# Altium project PCB_Project2.PrjPCB
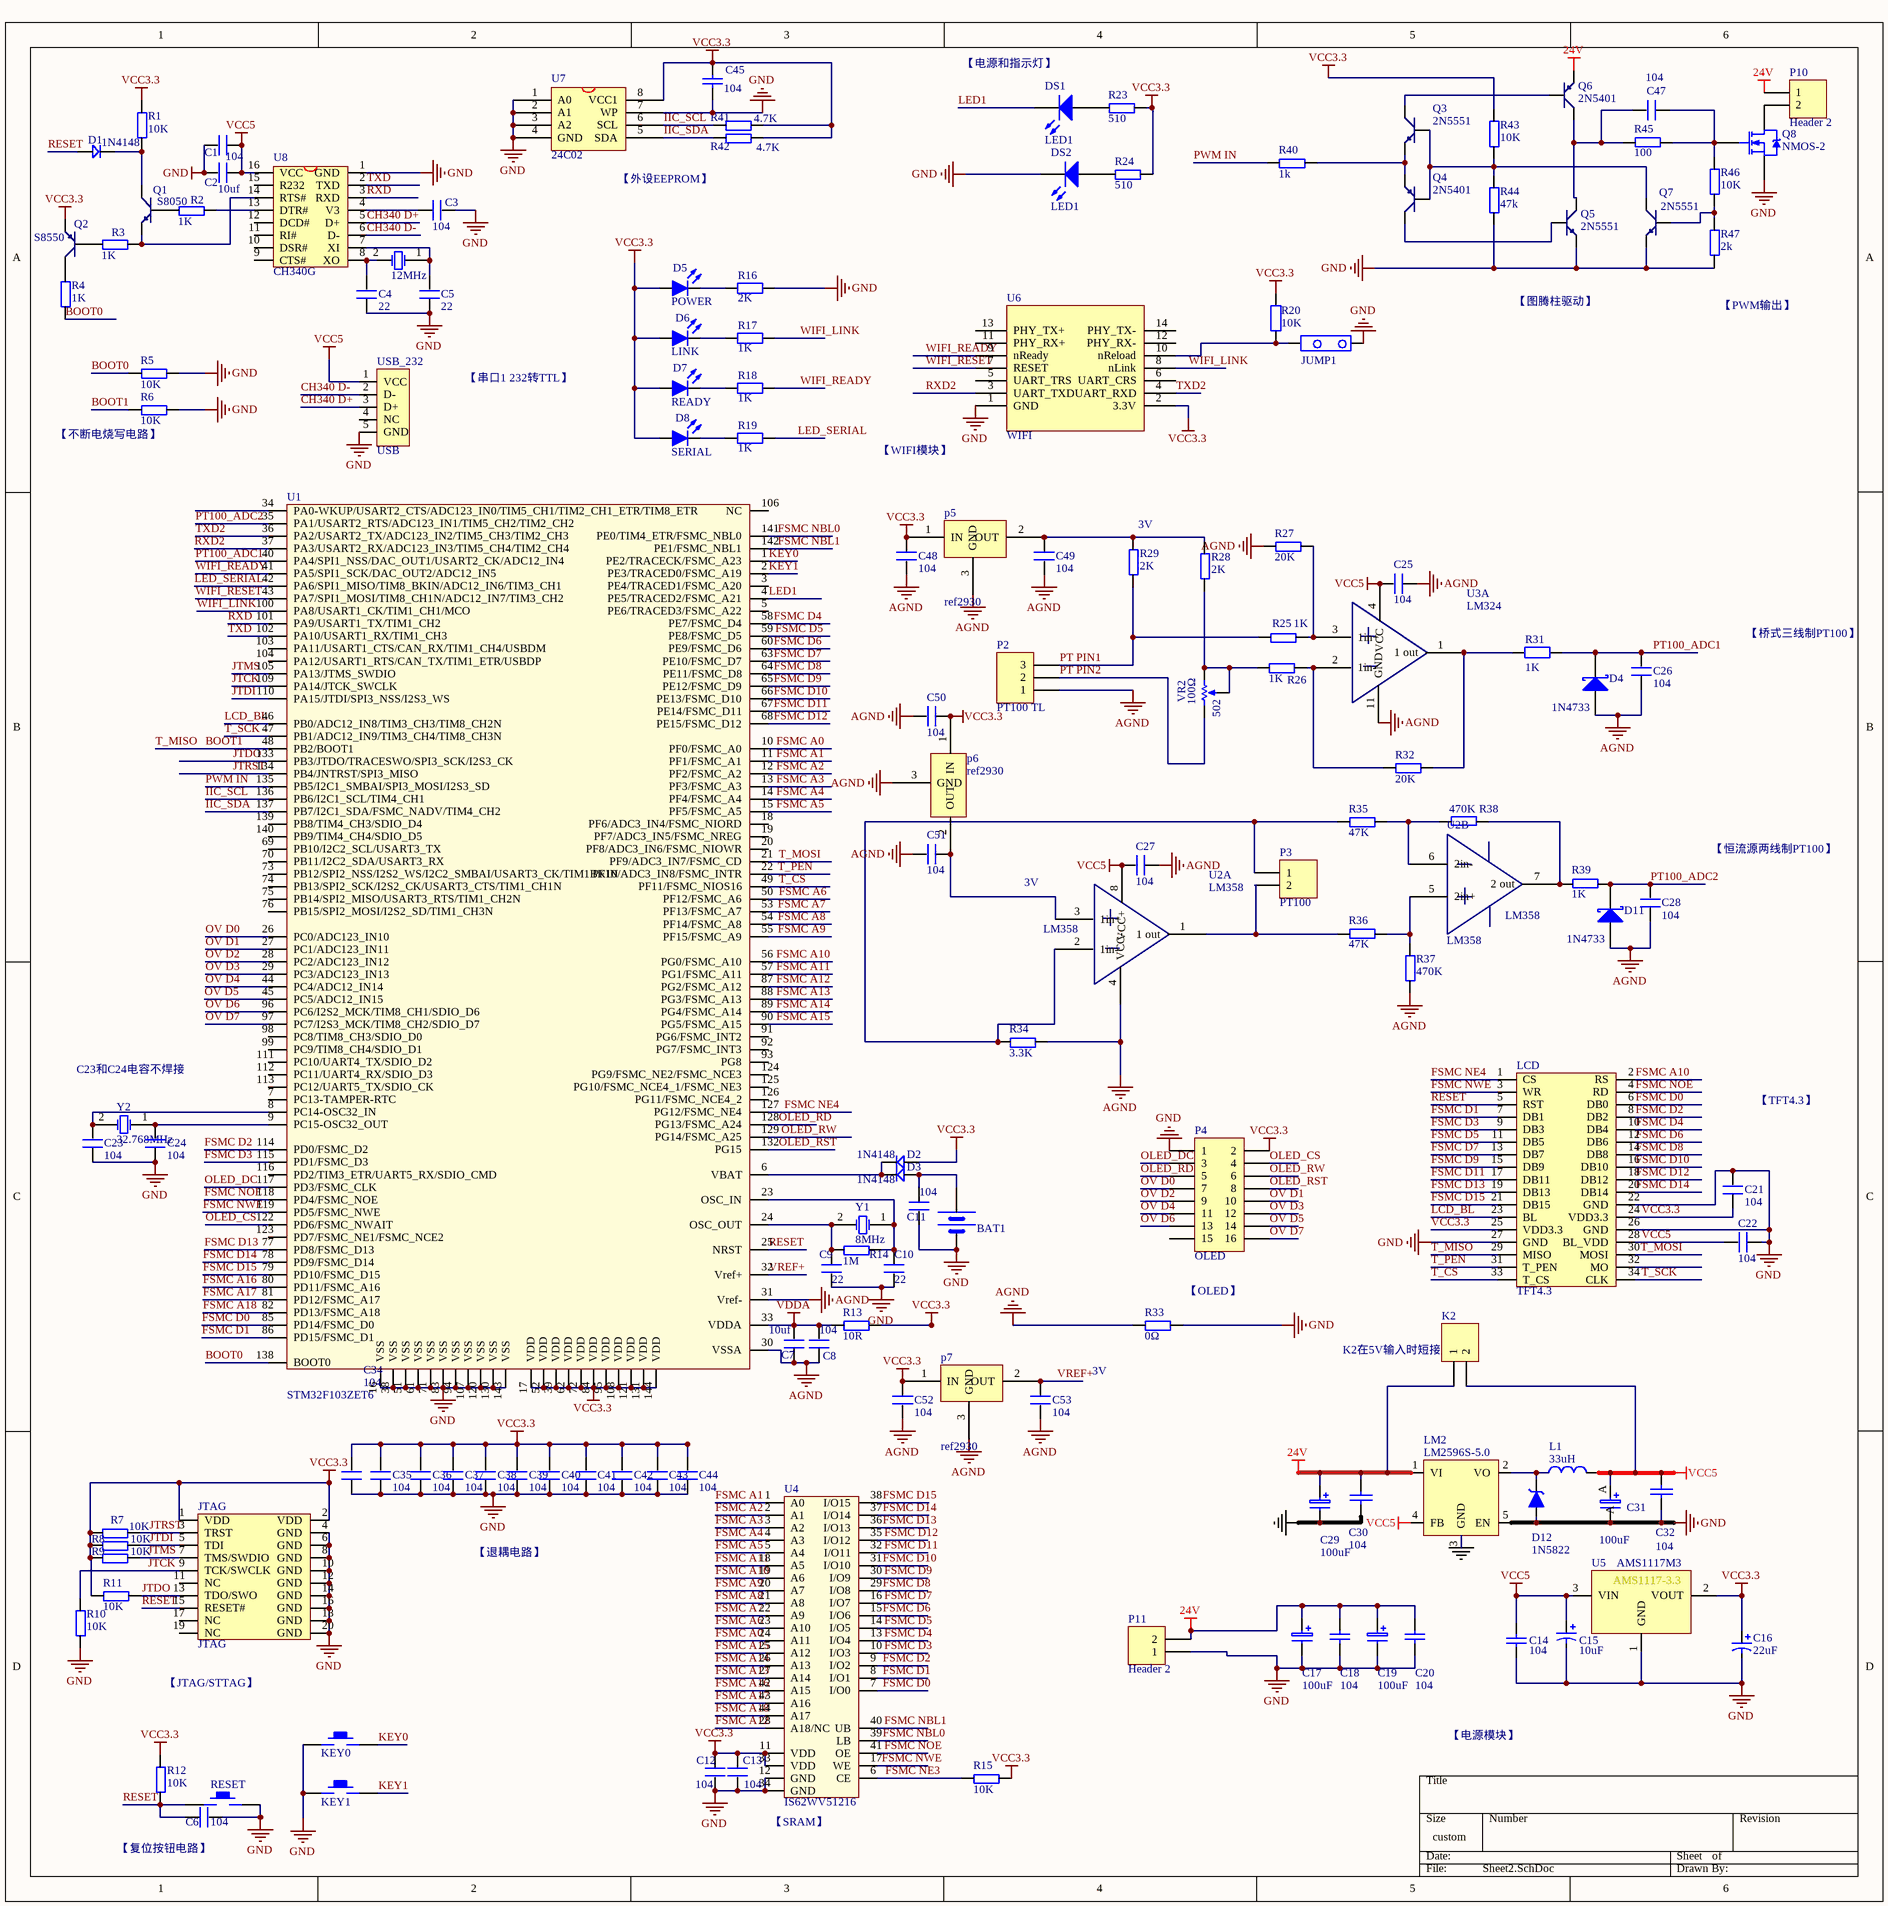
[diagram p0: Sheet2.SchDoc]
1 sheet, 146 parts. Net scope: global (net labels, ports and power ports of the same name join across sheets).
Board file: PCB1.PcbDoc

## Sheet Sheet2.SchDoc
size 381 x 381 mm

### Parts
BAT1  BATT  [BATM]  (value not drawn)
C1  104  [0805]
C2  10uf  [0805]
C3  104  [0805]
C4  22  [0805]
C5  22  [0805]
C6  104  [0805]
C7  10uf  [0805]
C8  104  [0805]
C9  22  [0805]
C10  22  [0805]
C11  104  [0805]
C12  104  [0805]
C13  104  [0805]
C14  104  [0805]
C15  10uF  [CASE-3216A]
C16  22uF  [RVT 22UF 25V]
C17  100uF  [CC8*10.5]
C18  104  [0805]
C19  100uF  [CC8*10.5]
C20  104  [0805]
C21  104  [0805]
C22  104  [0805]
C23  104  [0805]
C24  104  [0805]
C25  104  [0805]
C26  104  [0805]
C27  104  [0805]
C28  104  [0805]
C29  100uF  [CC8*10.5]
C30  104  [0805]
C31  100uF  [rvt 100uf /25V]
C32  104  [0805]
C34  104  [0805]
C35  104  [0805]
C36  104  [0805]
C37  104  [0805]
C38  104  [0805]
C39  104  [0805]
C40  104  [0805]
C41  104  [0805]
C42  104  [0805]
C43  104  [0805]
C44  104  [0805]
C45  value 104  [0805]  (hidden comment: Cap)
C47  104  [0805]
C48  104  [0805]
C49  104  [0805]
C50  104  [0805]
C51  104  [0805]
C52  104  [0805]
C53  104  [0805]
D1  1N4148  [DIODE_SOP]
D2  1N4148  [DIODE_SOP]
D3  1N4148  [DIODE_SOP]
D4  1N4733  [LC-DO-41]
D5  POWER  [SMDLED]
D6  LINK  [SMDLED]
D7  READY  [SMDLED]
D8  SERIAL  [SMDLED]
D11  1N4733  [LC-DO-41]
D12  1N5822  [1n5822]
DS1  LED1  [SMDLED]
DS2  LED1  [SMDLED]
JTAG  JTAG  [JTAG_20]
JUMP1  Jumper  [HDR1X2]  (value not drawn)
K2  Header 2  [HDR1X2]  (value not drawn)
KEY0  KEY_M  [KEY_M]  (value not drawn)
KEY1  KEY_M  [KEY_M]  (value not drawn)
L1  33uH  [100UH]
LCD  TFT4.3  [DB2*17-3.5]
LM2  LM2596S-5.0  [LM2596S-5.0]
P2  PT100 TL  [3SPI]
P3  PT100  [2SPI]
P4  OLED  [HDR2X8]
p5  ref2930  [LC-SOT-23(SOT-23-3)]
p6  ref2930  [LC-SOT-23(SOT-23-3)]
p7  ref2930  [LC-SOT-23(SOT-23-3)]
P10  Header 2  [2SPI]
P11  Header 2  [2SPI]
Q1  S8050  [SOT-23R]
Q2  S8550  [SOT-23R]
Q3  2N5551  [SOT-23R]
Q4  2N5401  [SOT-23R]
Q5  2N5551  [SOT-23R]
Q6  2N5401  [SOT-23R]
Q7  2N5551  [SOT-23R]
Q8  NMOS-2  [LC-TO-263-2]
R1  10K  [0805]
R2  1K  [0805]
R3  1K  [0805]
R4  1K  [0805]
R5  10K  [0805]
R6  10K  [0805]
R7  10K  [0805]
R8  10K  [0805]
R9  10K  [0805]
R10  10K  [0805]
R11  10K  [0805]
R12  10K  [0805]
R13  10R  [0805]
R14  1M  [0805]
R15  10K  [0805]
R16  2K  [0805]
R17  1K  [0805]
R18  1K  [0805]
R19  1K  [0805]
R20  10K  [0805]
R23  510  [0805]
R24  510  [0805]
R25  1K  [0805]
R26  1K  [0805]
R27  20K  [0805]
R28  2K  [0805]
R29  2K  [0805]
R31  value 1K  [0805]  (hidden comment: Res2)
R32  20K  [0805]
R33  0Ω  [0805]
R34  3.3K  [0805]
R35  47K  [0805]
R36  47K  [0805]
R37  470K  [0805]
R38  470K  [0805]
R39  1K  [0805]
R40  1k  [0805]
R41  4.7K  [0805]
R42  4.7K  [0805]
R43  10K  [0805]
R44  47k  [0805]
R45  100  [0805]
R46  10K  [0805]
R47  2k  [0805]
RESET  KEY_M  [KEY_M]  (value not drawn)
U1  STM32F103ZET6  [LQFP144]
U2  LM358  [LC-MSOP-8]  (parts A,B of 2)
U3  LM324  [LC-DIP-14]  (part A of 4)
U4  IS62WV51216  [TSOP44]
U5  AMS1117M3  [LC-SOT-223]
U6  WIFI  [USR-WIFI232]
U7  24C02  [SOP-8]
U8  CH340G  [SOP16M]
USB_232  USB  [USB/SM0.8-6H5]
VR2  502  value 100Ω  [503]
Y1  8MHz  [XTAL_US]
Y2  32.768MHz  [XTAL32]
Y3  12MHz  [XTAL_US]

### Nets
24V: C17.A C18.2 C19.A C20.2 C29.A C30.1 K2.1 LM2.1(VI) P10.1 P11.2 Q6.1(E)
AGND: C7.1 C8.2 C25.2 C26.1 C27.2 C28.1 C48.1 C49.1 C50.1 C51.1 C52.1 C53.1 D4.A D11.A P2.1 p5.3(GND) p6.3(GND) p7.3(GND) R27.1 R33.1 R34.2 R37.1 U1.30(VSSA) U1.31(Vref-) U2.4(VCC-) U3.11(GND)
GND: BAT1.2(GND) C1.1 C2.1 C3.2 C4.1 C5.1 C6.2 C9.1 C10.1 C11.1 C12.1 C13.1 C14.1 C15.K C16.K C17.K C18.1 C19.K C20.1 C21.2 C22.2 C23.1 C24.1 C29.K C30.2 C31.K C32.2 C34.1 C35.1 C36.1 C37.1 C38.1 C39.1 C40.1 C41.1 C42.1 C43.1 C44.1 C45.1 D12.A DS2.K JTAG.4(GND) JTAG.6(GND) JTAG.8(GND) JTAG.10(GND) JTAG.12(GND) JTAG.14(GND) JTAG.16(GND) JTAG.18(GND) JTAG.20(GND) JUMP1.2 KEY0.1 KEY1.1 LCD.22(GND) LCD.26(GND) LCD.27(GND) LM2.3(GND) LM2.5(EN) P4.1 P11.1 Q5.1(E) Q7.1(E) Q8.3(S) R5.2 R6.2 R10.1 R16.2 R33.2 R44.1 R47.1 RESET.2 U1.16(VSS) U1.38(VSS) U1.51(VSS) U1.61(VSS) U1.71(VSS) U1.83(VSS) U1.94(VSS) U1.107(VSS) U1.120(VSS) U1.130(VSS) U1.143(VSS) U4.12(GND) U4.34(GND) U5.1(GND) U6.1(GND) U7.1(A0) U7.2(A1) U7.3(A2) U7.4(GND) U7.7(WP) U8.1(GND) USB_232.5(GND)
VCC3.3: C12.2 C13.2 C16.A C21.1 C34.2 C35.2 C36.2 C37.2 C38.2 C39.2 C40.2 C41.2 C42.2 C43.2 C44.2 C45.2 C48.2 C50.2 C52.2 D2.1 D5.A D6.A D7.A D8.A JTAG.1(VDD) JTAG.2(VDD) LCD.24(VDD3.3) LCD.25(VDD3.3) P4.2 p5.1(IN) p6.1(IN) p7.1(IN) Q2.1(E) R1.2 R7.1 R8.1 R9.1 R11.1 R12.2 R13.2 R15.2 R20.2 R23.2 R24.2 R41.2 R42.2 R43.2 U1.17(VDD) U1.39(VDD) U1.52(VDD) U1.62(VDD) U1.72(VDD) U1.84(VDD) U1.95(VDD) U1.108(VDD) U1.121(VDD) U1.131(VDD) U1.144(VDD) U4.11(VDD) U4.33(VDD) U5.2(VOUT) U6.2(3.3V) U7.8(VCC1)
VCC5: C1.2 C2.2 C14.2 C15.A C22.1 C25.1 C27.1 C31.A C32.1 K2.2 L1.1 LCD.28(BL_VDD) LM2.4(FB) U2.8(VCC+) U3.4(VCC) U5.3(VIN) U8.16(VCC) USB_232.1(VCC)
VDDA: C7.2 C8.1 R13.1 U1.33(VDDA)
BOOT0: R4.1 R5.1 U1.138(BOOT0)
BOOT1: LCD.29(MISO) R6.1 U1.48(PB2/BOOT1)  [also labelled T_MISO]
CH340 D+: U8.5(D+) USB_232.3(D+)
CH340 D-: U8.6(D-) USB_232.2(D-)
FSMC A0: U1.10(PF0/FSMC_A0) U4.24(A11)
FSMC A1: U1.11(PF1/FSMC_A1) U4.1(A0)
FSMC A2: U1.12(PF2/FSMC_A2) U4.2(A1)
FSMC A3: U1.13(PF3/FSMC_A3) U4.3(A2)
FSMC A4: U1.14(PF4/FSMC_A4) U4.4(A3)
FSMC A5: U1.15(PF5/FSMC_A5) U4.5(A4)
FSMC A6: U1.50(PF12/FSMC_A6) U4.23(A10)
FSMC A7: U1.53(PF13/FSMC_A7) U4.22(A9)
FSMC A8: U1.54(PF14/FSMC_A8) U4.21(A8)
FSMC A9: U1.55(PF15/FSMC_A9) U4.20(A7)
FSMC A10: LCD.2(RS) U1.56(PG0/FSMC_A10) U4.19(A6)
FSMC A11: U1.57(PG1/FSMC_A11) U4.18(A5)
FSMC A12: U1.87(PG2/FSMC_A12) U4.28(A18/NC)
FSMC A13: U1.88(PG3/FSMC_A13) U4.27(A14)
FSMC A14: U1.89(PG4/FSMC_A14) U4.26(A13)
FSMC A15: U1.90(PG5/FSMC_A15) U4.25(A12)
FSMC A16: U1.80(PD11/FSMC_A16) U4.42(A15)
FSMC A17: U1.81(PD12/FSMC_A17) U4.43(A16)
FSMC A18: U1.82(PD13/FSMC_A18) U4.44(A17)
FSMC D0: LCD.6(DB0) U1.85(PD14/FSMC_D0) U4.7(I/O0)
FSMC D1: LCD.7(DB1) U1.86(PD15/FSMC_D1) U4.8(I/O1)
FSMC D2: LCD.8(DB2) U1.114(PD0/FSMC_D2) U4.9(I/O2)
FSMC D3: LCD.9(DB3) U1.115(PD1/FSMC_D3) U4.10(I/O3)
FSMC D4: LCD.10(DB4) U1.58(PE7/FSMC_D4) U4.13(I/O4)
FSMC D5: LCD.11(DB5) U1.59(PE8/FSMC_D5) U4.14(I/O5)
FSMC D6: LCD.12(DB6) U1.60(PE9/FSMC_D6) U4.15(I/O6)
FSMC D7: LCD.13(DB7) U1.63(PE10/FSMC_D7) U4.16(I/O7)
FSMC D8: LCD.14(DB8) U1.64(PE11/FSMC_D8) U4.29(I/O8)
FSMC D9: LCD.15(DB9) U1.65(PE12/FSMC_D9) U4.30(I/O9)
FSMC D10: LCD.16(DB10) U1.66(PE13/FSMC_D10) U4.31(I/O10)
FSMC D11: LCD.17(DB11) U1.67(PE14/FSMC_D11) U4.32(I/O11)
FSMC D12: LCD.18(DB12) U1.68(PE15/FSMC_D12) U4.35(I/O12)
FSMC D13: LCD.19(DB13) U1.77(PD8/FSMC_D13) U4.36(I/O13)
FSMC D14: LCD.20(DB14) U1.78(PD9/FSMC_D14) U4.37(I/O14)
FSMC D15: LCD.21(DB15) U1.79(PD10/FSMC_D15) U4.38(I/O15)
FSMC NBL0: U1.141(PE0/TIM4_ETR/FSMC_NBL0) U4.39(LB)
FSMC NBL1: U1.142(PE1/FSMC_NBL1) U4.40(UB)
FSMC NE3: R15.1 U4.6(CE)
FSMC NE4: LCD.1(CS) U1.127(PG12/FSMC_NE4)
FSMC NOE: LCD.4(RD) U1.118(PD4/FSMC_NOE) U4.41(OE)
FSMC NWE: LCD.3(WR) U1.119(PD5/FSMC_NWE) U4.17(WE)
IIC_SCL: R41.1 U1.136(PB6/I2C1_SCL/TIM4_CH1) U7.6(SCL)
IIC_SDA: R42.1 U1.137(PB7/I2C1_SDA/FSMC_NADV/TIM4_CH2) U7.5(SDA)
JTCK: JTAG.9(TCK/SWCLK) R10.2 U1.109(PA14/JTCK_SWCLK)
JTDI: JTAG.5(TDI) R8.2 U1.110(PA15/JTDI/SPI3_NSS/I2S3_WS)
JTDO: JTAG.13(TDO/SWO) R11.2 U1.133(PB3/JTDO/TRACESWO/SPI3_SCK/I2S3_CK)
JTMS: JTAG.7(TMS/SWDIO) R9.2 U1.105(PA13/JTMS_SWDIO)
JTRST: JTAG.3(TRST) R7.2 U1.134(PB4/JNTRST/SPI3_MISO)
KEY0: KEY0.2 U1.1(PE2/TRACECK/FSMC_A23)
KEY1: KEY1.2 U1.2(PE3/TRACED0/FSMC_A19)
LCD_BL: LCD.23(BL) U1.46(PB0/ADC12_IN8/TIM3_CH3/TIM8_CH2N)
LED1: DS1.K U1.4(PE5/TRACED2/FSMC_A21)
LED_SERIAL: R19.2 U1.42(PA6/SPI1_MISO/TIM8_BKIN/ADC12_IN6/TIM3_CH1)
OLED_CS: P4.4 U1.122(PD6/FSMC_NWAIT)
OLED_DC: P4.3 U1.117(PD3/FSMC_CLK)
OLED_RD: P4.5 U1.128(PG13/FSMC_A24)
OLED_RST: P4.8 U1.132(PG15)
OLED_RW: P4.6 U1.129(PG14/FSMC_A25)
OV D0: P4.7 U1.26(PC0/ADC123_IN10)
OV D1: P4.10 U1.27(PC1/ADC123_IN11)
OV D2: P4.9 U1.28(PC2/ADC123_IN12)
OV D3: P4.12 U1.29(PC3/ADC123_IN13)
OV D4: P4.11 U1.44(PC4/ADC12_IN14)
OV D5: P4.14 U1.45(PC5/ADC12_IN15)
OV D6: P4.13 U1.96(PC6/I2S2_MCK/TIM8_CH1/SDIO_D6)
OV D7: P4.16 U1.97(PC7/I2S3_MCK/TIM8_CH2/SDIO_D7)
PT100_ADC1: C26.2 D4.K R31.2 U1.40(PA4/SPI1_NSS/DAC_OUT1/USART2_CK/ADC12_IN4)
PT100_ADC2: C28.2 D11.k(K) R39.1 U1.35(PA1/USART2_RTS/ADC123_IN1/TIM5_CH2/TIM2_CH2)
PT PIN1: P2.3 R25.1 R29.1
PT PIN2: P2.2 VR2.1(TOP)
PWM IN: R40.1 U1.135(PB5/I2C1_SMBAI/SPI3_MOSI/I2S3_SD)
RESET: C6.1 D1.1 JTAG.15(RESET#) LCD.5(RST) R12.1 RESET.1 U1.25(NRST)
RXD: U1.101(PA9/USART1_TX/TIM1_CH2) U8.3(RXD)
RXD2: U1.37(PA3/USART2_RX/ADC123_IN3/TIM5_CH4/TIM2_CH4) U6.3(UART_TXD)
T_CS: LCD.33(T_CS) U1.49(PF11/FSMC_NIOS16)
T_MOSI: LCD.30(MOSI) U1.21(PF9/ADC3_IN7/FSMC_CD)
T_PEN: LCD.31(T_PEN) U1.22(PF10/ADC3_IN8/FSMC_INTR)
T_SCK: LCD.34(CLK) U1.47(PB1/ADC12_IN9/TIM3_CH4/TIM8_CH3N)
TXD: U1.102(PA10/USART1_RX/TIM1_CH3) U8.2(TXD)
TXD2: U1.36(PA2/USART2_TX/ADC123_IN2/TIM5_CH3/TIM2_CH3) U6.4(UART_RXD)
VREF+: C53.2 p7.2(OUT) U1.32(Vref+)
WIFI_LINK: R17.2 U1.100(PA8/USART1_CK/TIM1_CH1/MCO) U6.8(nLink)
WIFI_READY: R18.2 U1.41(PA5/SPI1_SCK/DAC_OUT2/ADC12_IN5) U6.9(nReady)
WIFI_RESET: U1.43(PA7/SPI1_MOSI/TIM8_CH1N/ADC12_IN7/TIM3_CH2) U6.7(RESET)
NetBAT1_1: BAT1.1(VCC) C11.2 D3.1
NetC3_1: C3.1 U8.4(V3)
NetC4_2: C4.2 U8.8(XO) Y3.2(OSC2)
NetC5_2: C5.2 U8.7(XI) Y3.1(OSC1)
NetC9_2: C9.2 R14.1 U1.24(OSC_OUT) Y1.2(OSC2)
NetC10_2: C10.2 R14.2 U1.23(OSC_IN) Y1.1(OSC1)
NetC23_2: C23.2 U1.8(PC14-OSC32_IN) Y2.2(OSC2)
NetC24_2: C24.2 U1.9(PC15-OSC32_OUT) Y2.1(OSC1)
NetC47_1: C47.1 Q5.3(C) Q6.3(C) R45.2
NetC47_2: C47.2 Q8.1(G) R45.1 R46.2
NetC49_2: C49.2 p5.2(OUT) R28.2 R29.2
NetC51_2: C51.2 p6.2(OUT) U2.3(1in+)
NetD1_2: D1.2 Q1.3(C) R1.1
NetD2_2: D2.2 D3.2 U1.6(VBAT)
NetD5_K: D5.K R16.1
NetD6_K: D6.K R17.1
NetD7_K: D7.K R18.1
NetD8_K: D8.K R19.1
NetD12_K: D12.K L1.2 LM2.2(VO)
NetDS1_A: DS1.A R23.1
NetDS2_A: DS2.A R24.1
NetJUMP1_1: JUMP1.1 R20.1 U6.10(nReload)
NetP3_1: P3.1 R34.1 R35.1 U2.2(1in-)
NetP3_2: P3.2 R36.2 U2.1(1_out)
NetP10_2: P10.2 Q8.2(D)
NetQ1_1: Q1.1(E) R3.2 U8.14(RTS#)
NetQ1_2: Q1.2(B) R2.1
NetQ2_2: Q2.2(B) R3.1
NetQ2_3: Q2.3(C) R4.2
NetQ3_1: Q3.1(E) Q4.1(E) R40.2
NetQ3_2: Q3.2(B) Q4.2(B) Q7.3(C) R43.1 R44.2
NetQ3_3: Q3.3(C) Q6.2(B)
NetQ4_3: Q4.3(C) Q5.2(B)
NetQ7_2: Q7.2(B) R46.1 R47.2
NetR2_2: R2.2 U8.13(DTR#)
NetR25_2: R25.2 R27.2 U3.3(1in+)
NetR26_1: R26.1 R28.1 VR2.2(BOT) VR2.3(TAP)
NetR26_2: R26.2 R32.1 U3.2(1in-)
NetR31_1: R31.1 R32.2 U3.1(1_out)
NetR35_2: R35.2 R38.2 U2.6(2in-)
NetR36_1: R36.1 R37.2 U2.5(2in+)
NetR38_1: R38.1 R39.2 U2.7(2_out)

Not connected (* = marked no-connect by the designer): JTAG 11(NC) 17(NC) 19(NC); LCD 32(MO); P4 15; U1 3(PE4/TRACED1/FSMC_A20) 5(PE6/TRACED3/FSMC_A22) 7(PC13-TAMPER-RTC) 18(PF6/ADC3_IN4/FSMC_NIORD) 19(PF7/ADC3_IN5/FSMC_NREG) 20(PF8/ADC3_IN6/FSMC_NIOWR) 34(PA0-WKUP/USART2_CTS/ADC123_IN0/TIM5_CH1/TIM2_CH1_ETR/TIM8_ETR) 69(PB10/I2C2_SCL/USART3_TX) 70(PB11/I2C2_SDA/USART3_RX) 73(PB12/SPI2_NSS/I2S2_WS/I2C2_SMBAI/USART3_CK/TIM1BKIN) 74(PB13/SPI2_SCK/I2S2_CK/USART3_CTS/TIM1_CH1N) 75(PB14/SPI2_MISO/USART3_RTS/TIM1_CH2N) 76(PB15/SPI2_MOSI/I2S2_SD/TIM1_CH3N) 91(PG6/FSMC_INT2) 92(PG7/FSMC_INT3) 93(PG8) 98(PC8/TIM8_CH3/SDIO_D0) 99(PC9/TIM8_CH4/SDIO_D1) 103(PA11/USART1_CTS/CAN_RX/TIM1_CH4/USBDM) 104(PA12/USART1_RTS/CAN_TX/TIM1_ETR/USBDP) 106(NC) 111(PC10/UART4_TX/SDIO_D2) 112(PC11/UART4_RX/SDIO_D3) 113(PC12/UART5_TX/SDIO_CK) 116(PD2/TIM3_ETR/UART5_RX/SDIO_CMD) 123(PD7/FSMC_NE1/FSMC_NCE2) 124(PG9/FSMC_NE2/FSMC_NCE3) 125(PG10/FSMC_NCE4_1/FSMC_NE3) 126(PG11/FSMC_NCE4_2) 139(PB8/TIM4_CH3/SDIO_D4) 140(PB9/TIM4_CH4/SDIO_D5); U6 5(UART_TRS) 6(UART_CRS) 11(PHY_RX+) 12(PHY_RX-) 13(PHY_TX+) 14(PHY_TX-); U8 9(CTS#) 10(DSR#) 11(RI#) 12(DCD#) 15(R232); USB_232 4(NC)

### Notes on the sheet
- 【电源和指示灯】
- (near U7) 【外设EEPROM】
- 【图腾柱驱动】
- (near R47) 【PWM输出】
- 【串口1 232转TTL】
- (near R6) 【不断电烧写电路】
- 【WIFI模块】
- (near R29) 3V
- 【桥式三线制PT100】
- 【恒流源两线制PT100】
- 3V
- (near U2) LM358
- C23和C24电容不焊接
- 【TFT4.3】
- 【OLED】
- K2在5V输入时短接
- 【退耦电路】
- (near JTAG) 【JTAG/STTAG】
- 【电源模块】
- 【复位按钮电路】
- (near U4) 【SRAM】

### Library data of the parts
BAT1 = BAT
C1-C13 C21-C28 C34-C44 C47-C53 = C
C14 = Cap1: Value: 0.1uF
C15 C16 = Cap2: Value: 100uF
C17 C19 C29 C31 = Cap3: Value: 10uF
C18 C20 = Cap1: Value: 20pF; Value: 103; Value: 0.1uF; Value: 104
C30 = CAP: Part Field 1: 0; Part Field 10: 1000u; Part Field 2: 0; Part Field 3: 0; Part Field 4: 0; Part Field 5: 1; Part Field 6: 0; Part Field 7: 1u; Part Field 8: 1u; Part Field 9: 500u
C32 = CAP
C45 = Cap: Capacitor; Published: 8-Jun-2000; LatestRevisionDate: 17-Jul-2002; LatestRevisionNote: Re-released for DXP Platform.; PackageReference: RAD-0.3; Publisher: Altium Limited
D1-D3 = D
D4 D11 = Diode 18TQ045: Schottky Rectifier; Note: Terminal 2 is the TAB and is electrically connected to the cathode; Published: 8-Jun-2000; LatestRevisionDate: 17-Jul-2002; LatestRevisionNote: Re-released for DXP Platform.; DatasheetVersion: Dec-1997; PackageVersion: Feb-1998; PackageReference: TO-220AC; Publisher: Altium Limited; ComponentLink1Description: Manufacturer Link; ComponentLink1URL: http://www.irf.com/; ComponentLink2Description: Datasheet; ComponentLink2URL: http://www.irf.com/product-info/datasheets/data/18tq.pdf
D5-D8 = LED1
D12 = ZENER3: Zener Diode
DS1 DS2 = LED2: Typical RED, GREEN, YELLOW, AMBER GaAs LED; Published: 8-Jun-2000; LatestRevisionDate: 17-Jul-2002; LatestRevisionNote: Re-released for DXP Platform.; PackageDocument: Feb-2002; PackageReference: 3.2X1.6X1.1; Publisher: Altium Limited
K2 P3 P10 P11 = Header 2: Header, 2-Pin; LatestRevisionDate: 17-Jul-2002; LatestRevisionNote: Re-released for DXP Platform.; Publisher: Altium Limited
L1 = L
LCD = TFT_LCD2
LM2 = 12V-5V
P2 = Header 3: Header, 3-Pin; LatestRevisionDate: 17-Jul-2002; LatestRevisionNote: Re-released for DXP Platform.; Publisher: Altium Limited
P4 = Header 8X2: Header, 8-Pin, Dual row; LatestRevisionDate: 17-Jul-2002; LatestRevisionNote: Re-released for DXP Platform.; Publisher: Altium Limited
Q1 Q3 Q5 Q7 = NPN: 8050/BCW846/BCW847
Q2 Q4 Q6 = PNP: 8550/BCW68
Q8 = NMOS-2: N-Channel Power MOSFET; Note: Pin 2 is electrically connected to pin 4.; Published: 8-Jun-2000; LatestRevisionDate: 17-Jul-2002; LatestRevisionNote: Re-released for DXP Platform.; DatasheetVersion: PD-9.814; PackageReference: TO-220AB; Publisher: Altium Limited; Code_JEDEC: TO-220-AB; ComponentLink1Description: Manufacturer Link; ComponentLink1URL: http://www.irf.com/
R1-R15 R23-R29 R32-R47 = R
R16 R20 = Res1: Value: 1K
R17-R19 = Res1: Value: 1K
R31 = Res2: Resistor; Published: 8-Jun-2000; LatestRevisionDate: 17-Jul-2002; LatestRevisionNote: Re-released for DXP Platform.; PackageReference: AXIAL-0.4; Publisher: Altium Limited
U4 = IS61LV51216
U5 = AMS1117-3.3
U6 = USR-WIFI232-ABD
U7 = 24C256
U8 = CH340G: USB2UART
USB_232 = USB5
VR2 = RPot: Potentiometer; Sim Note: Enter the Resistance value and the set point into parameter fields.; Set Position: 0.5; Published: 8-Jun-2000; LatestRevisionDate: 17-Jul-2002; LatestRevisionNote: Re-released for DXP Platform.; PackageReference: VR5; Publisher: Altium Limited
Y1-Y3 = XTAL: Crystal Oscillator; Published: 8-Jun-2000; LatestRevisionDate: 17-Jul-2002; LatestRevisionNote: Re-released for DXP Platform.; Publisher: Altium Limited